# Altium schematic sheet vme_sys_buff.SchDoc
size A4
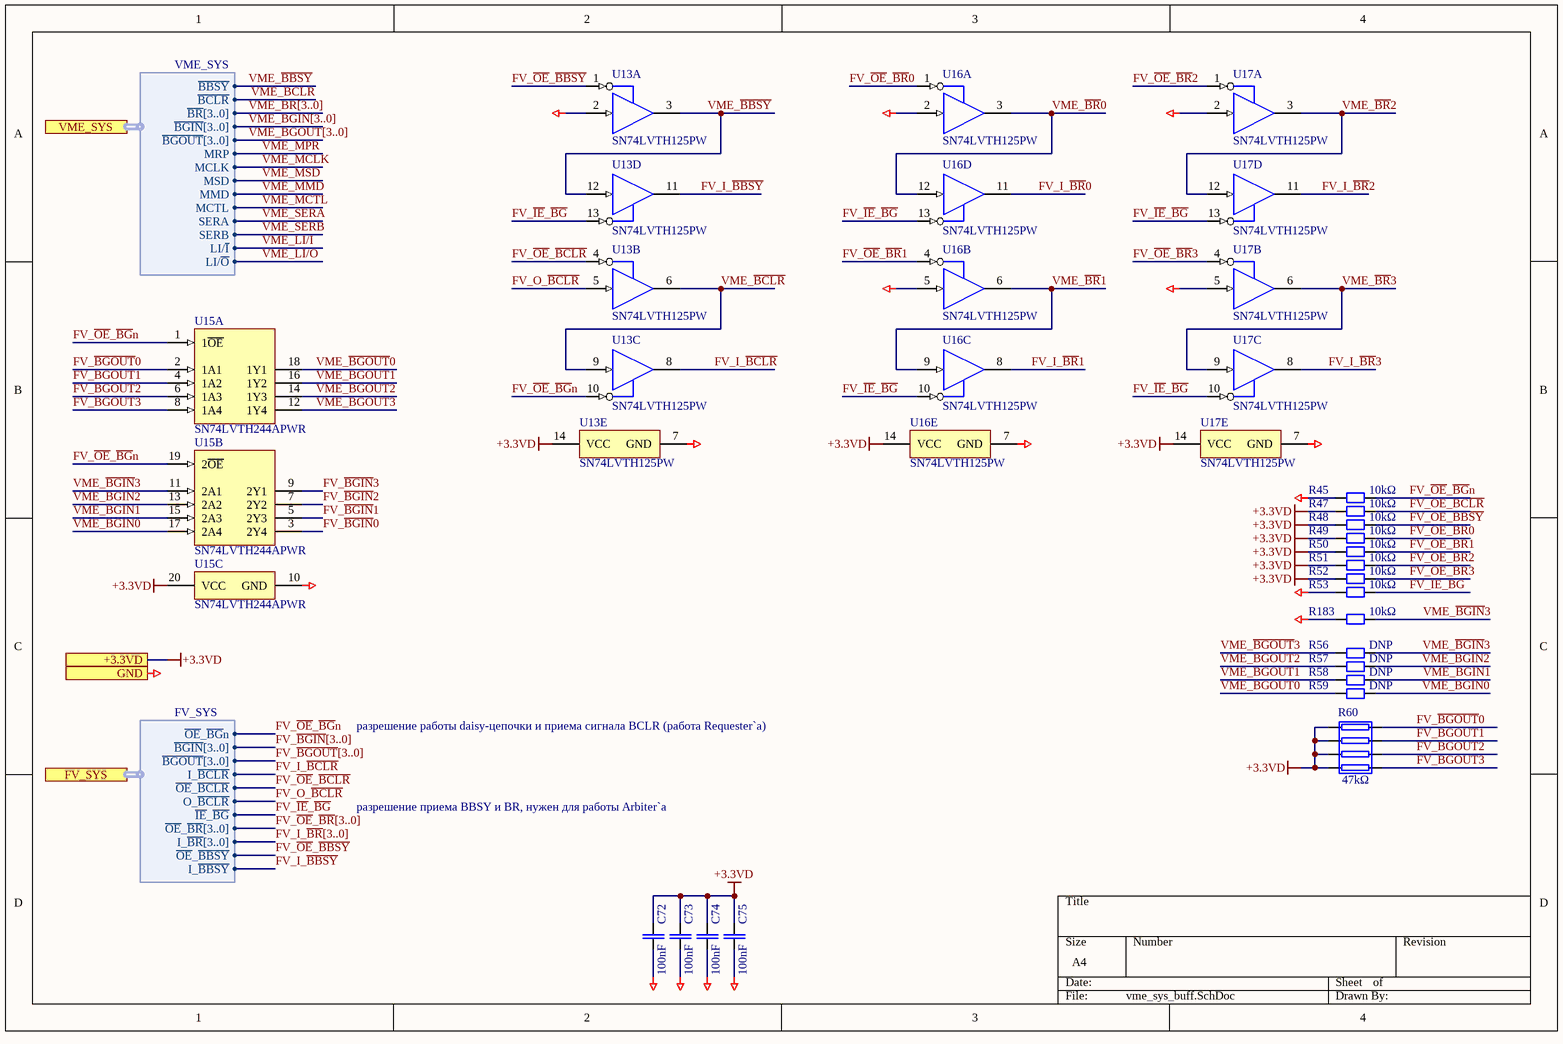
[diagram p0: vme_sys_buff.SchDoc]

## Parts
C72  100nF  [CAPC1608N]
C73  100nF  [CAPC1608N]
C74  100nF  [CAPC1608N]
C75  100nF  [CAPC1608N]
R45  10kΩ  [RESC2012N]
R47  10kΩ  [RESC2012N]
R48  10kΩ  [RESC2012N]
R49  10kΩ  [RESC2012N]
R50  10kΩ  [RESC2012N]
R51  10kΩ  [RESC2012N]
R52  10kΩ  [RESC2012N]
R53  10kΩ  [RESC2012N]
R56  DNP  [RESC1608N]
R57  DNP  [RESC1608N]
R58  DNP  [RESC1608N]
R59  DNP  [RESC1608N]
R60  value 47kΩ  [CAY16-J4]  (hidden comment: CAY16-4702F4LF)
R183  10kΩ  [RESC2012N]
U13  SN74LVTH125PW  [PW0014A_N]  (parts A,B,C,D,E of 5)
U15  SN74LVTH244APWR  [PW0020A_N]  (parts A,B,C of 3)
U16  SN74LVTH125PW  [PW0014A_N]  (parts A,B,C,D,E of 5)
U17  SN74LVTH125PW  [PW0014A_N]  (parts A,B,C,D,E of 5)

## Ports
+3.3VD, FV_SYS (harness FV_SYS), GND, VME_SYS (harness VME_SYS)

## Harnesses
VME_SYS: ~{BBSY}, ~{BCLR}, ~{BR}[3..0], ~{BGIN}[3..0], ~{BGOUT}[3..0], MRP, MCLK, MSD, MMD, MCTL, SERA, SERB, LI/~{I}, LI/~{O}
FV_SYS: ~{OE}_~{BG}n, ~{BGIN}[3..0], ~{BGOUT}[3..0], I_~{BCLR}, ~{OE}_~{BCLR}, O_~{BCLR}, ~{IE}_~{BG}, ~{OE}_~{BR}[3..0], I_~{BR}[3..0], ~{OE}_~{BBSY}, I_~{BBSY}

## Nets
+3.3VD: C72.2 C73.2 C74.2 C75.2 R47.1 R48.1 R49.1 R50.1 R51.1 R52.1 R60.1 R60.2 R60.3 R60.4 U13.14(VCC) U15.20(VCC) U16.14(VCC) U17.14(VCC) ; port +3.3VD
GND: C72.1 C73.1 C74.1 C75.1 R45.1 R53.1 R183.1 U13.2(1A) U13.7(GND) U15.10(GND) U16.2(1A) U16.5(2A) U16.7(GND) U17.2(1A) U17.5(2A) U17.7(GND) ; port GND
FV_~{BGIN}0: U15.3(2Y4)
FV_~{BGIN}1: U15.5(2Y3)
FV_~{BGIN}2: U15.7(2Y2)
FV_~{BGIN}3: U15.9(2Y1)
FV_~{BGOUT}0: R60.5 U15.2(1A1)
FV_~{BGOUT}1: R60.6 U15.4(1A2)
FV_~{BGOUT}2: R60.7 U15.6(1A3)
FV_~{BGOUT}3: R60.8 U15.8(1A4)
FV_~{IE}_~{BG}: R53.2 U13.13(4~{OE}) U16.10(3~{OE}) U16.13(4~{OE}) U17.10(3~{OE}) U17.13(4~{OE}) ; port FV_SYS.~{IE}_~{BG}
FV_I_~{BBSY}: U13.11(4Y) ; port FV_SYS.I_~{BBSY}
FV_I_~{BCLR}: U13.8(3Y) ; port FV_SYS.I_~{BCLR}
FV_I_~{BR}0: U16.11(4Y)
FV_I_~{BR}1: U16.8(3Y)
FV_I_~{BR}2: U17.11(4Y)
FV_I_~{BR}3: U17.8(3Y)
FV_~{OE}_~{BBSY}: R48.2 U13.1(1~{OE}) ; port FV_SYS.~{OE}_~{BBSY}
FV_~{OE}_~{BCLR}: R47.2 U13.4(2~{OE}) ; port FV_SYS.~{OE}_~{BCLR}
FV_~{OE}_~{BG}n: R45.2 U13.10(3~{OE}) U15.1(1~{OE}) U15.19(2~{OE}) ; port FV_SYS.~{OE}_~{BG}n
FV_~{OE}_~{BR}0: R49.2 U16.1(1~{OE})
FV_~{OE}_~{BR}1: R50.2 U16.4(2~{OE})
FV_~{OE}_~{BR}2: R51.2 U17.1(1~{OE})
FV_~{OE}_~{BR}3: R52.2 U17.4(2~{OE})
FV_O_~{BCLR}: U13.5(2A) ; port FV_SYS.O_~{BCLR}
VME_~{BBSY}: U13.3(1Y) U13.12(4A) ; port VME_SYS.~{BBSY}
VME_~{BCLR}: U13.6(2Y) U13.9(3A) ; port VME_SYS.~{BCLR}
VME_~{BGIN}0: R59.2 U15.17(2A4)
VME_~{BGIN}1: R58.2 U15.15(2A3)
VME_~{BGIN}2: R57.2 U15.13(2A2)
VME_~{BGIN}3: R56.2 R183.2 U15.11(2A1)
VME_~{BGOUT}0: R59.1 U15.18(1Y1)
VME_~{BGOUT}1: R58.1 U15.16(1Y2)
VME_~{BGOUT}2: R57.1 U15.14(1Y3)
VME_~{BGOUT}3: R56.1 U15.12(1Y4)
VME_~{BR}0: U16.3(1Y) U16.12(4A)
VME_~{BR}1: U16.6(2Y) U16.9(3A)
VME_~{BR}2: U17.3(1Y) U17.12(4A)
VME_~{BR}3: U17.6(2Y) U17.9(3A)
VME_LI/~{I}: port VME_SYS.LI/~{I}
VME_LI/~{O}: port VME_SYS.LI/~{O}
VME_MCLK: port VME_SYS.MCLK
VME_MCTL: port VME_SYS.MCTL
VME_MMD: port VME_SYS.MMD
VME_MPR: port VME_SYS.MRP
VME_MSD: port VME_SYS.MSD
VME_SERA: port VME_SYS.SERA
VME_SERB: port VME_SYS.SERB

## Buses and harness runs
bus FV_I_~{BR}[3..0]
bus FV_~{BGIN}[3..0]
bus FV_~{BGOUT}[3..0]
bus FV_~{OE}_~{BR}[3..0]
bus VME_~{BGIN}[3..0]
bus VME_~{BGOUT}[3..0]
bus VME_~{BR}[3..0]

## Notes on the sheet
- разрешение работы daisy-цепочки и приема сигнала BCLR (работа Requester`а)
- разрешение приема BBSY и BR, нужен для работы Arbiter`а

## Library data of the parts
C72-C75 = CAPC: Generic ceramic SMD capacitor; Pkg: 0603; Maintainer: Evgeniy Kotov; SMD Solders: 2; THD Solders: 0; PartField: 100nF; Last Change Data: 06.03.2017; Release Date: 06.03.2017; Value: 100nF
R45 R47-R53 R183 = RESC: Resistor, Generic, SMD; Pkg: 0805; Maintainer: Evgeniy Kotov; SMD Solders: 2; THD Solders: 0; PartField: 10kΩ; Release Date: 06.03.2017; Last Change Data: 09.03.2017; Value: 10kΩ
R56-R59 = RESC: Resistor, Generic, SMD; PartField: 0Ω; Pkg: 0603; Maintainer: Evgeniy Kotov; SMD Solders: 2; THD Solders: 0; Release Date: 06.03.2017; Last Change Data: 09.03.2017; Value: DNP
R60 = RESPACK4: Maintainer: Anton Pavlenko; Pkg: SMD 8pin; SMD Solders: 8; THD Solders: 0; PartField: CAY16-4702F4LF; Last Change Data: 16.05.2019; Release Date: 16.05.2019
U13 U16 U17 = CMP-0440-00201-3: 3.3-V ABT Quadruple Bus Buffers With 3-State Outputs, PW0014A, TUBE; Manufacturer: Texas Instruments; ICC @ Nom Voltage(Max)(mA): 0.007; Rating: Catalog; VCC(Min)(V): 2.7; F @ Nom Voltage(Max)(Mhz): 160; VCC(Max)(V): 3.6; Voltage(Nom)(V): 3.3; tpd @ Nom Voltage(Max)(ns): 3.5; Output Type: CMOS; Bits(#): 4; Input Type: TTL; Pkg: TSSOP-14N; SMD Solders: 14; THD Solders: 0; PackageReference: PW0014A; DatasheetVersion: SCBS703I; Operating Temperature Range(C): -40 to 85; PackageVersion: http://www.ti.com/lit/ml/mpds360/mpds360.pdf; Generic Part Number: SN74LVTH125; Code_JEDEC: MO-153; PartField: SN74LVTH125; Value: SN74LVTH125
U15 = CMP-0440-01187-3: 3.3-V ABT Octal Buffers/Drivers With 3-State Outputs, PW0020A, LARGE T&R; Manufacturer: Texas Instruments; Voltage(Nom)(V): 3.3; ICC @ Nom Voltage(Max)(mA): 0.005; tpd @ Nom Voltage(Max)(ns): 3.5; Input Type: TTL; VCC(Max)(V): 3.6; Rating: Catalog; VCC(Min)(V): 2.7; Bits(#): 8; F @ Nom Voltage(Max)(Mhz): 160; Output Type: LVTTL; Pkg: TSSOP-20N; SMD Solders: 20; THD Solders: 0; DatasheetVersion: SCAS586J; Generic Part Number: SN74LVTH244A; PackageReference: PW0020A; Operating Temperature Range(C): -40 to 85; Code_JEDEC: MO-153; PackageVersion: http://www.ti.com/lit/ml/mpds362/mpds362.pdf; PartId: 1; PartField: SN74LVTH244A; Value: SN74LVTH244A